# Altium schematic sheet dsPIC33_CPU_ETH_Unit.SchDoc
size A1
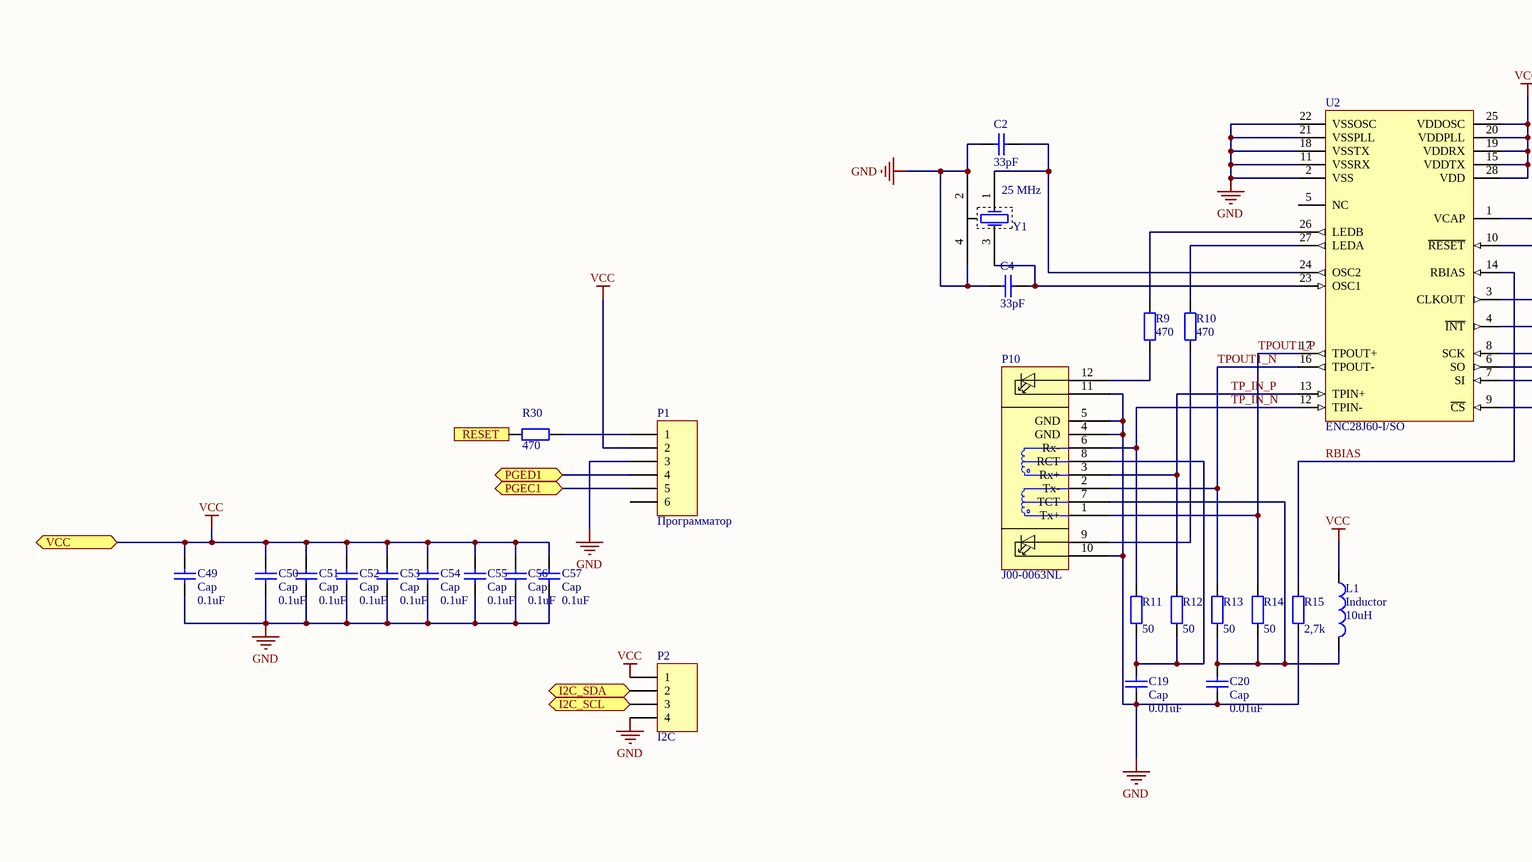
[diagram p0: dsPIC33_CPU_ETH_Unit.SchDoc, left]
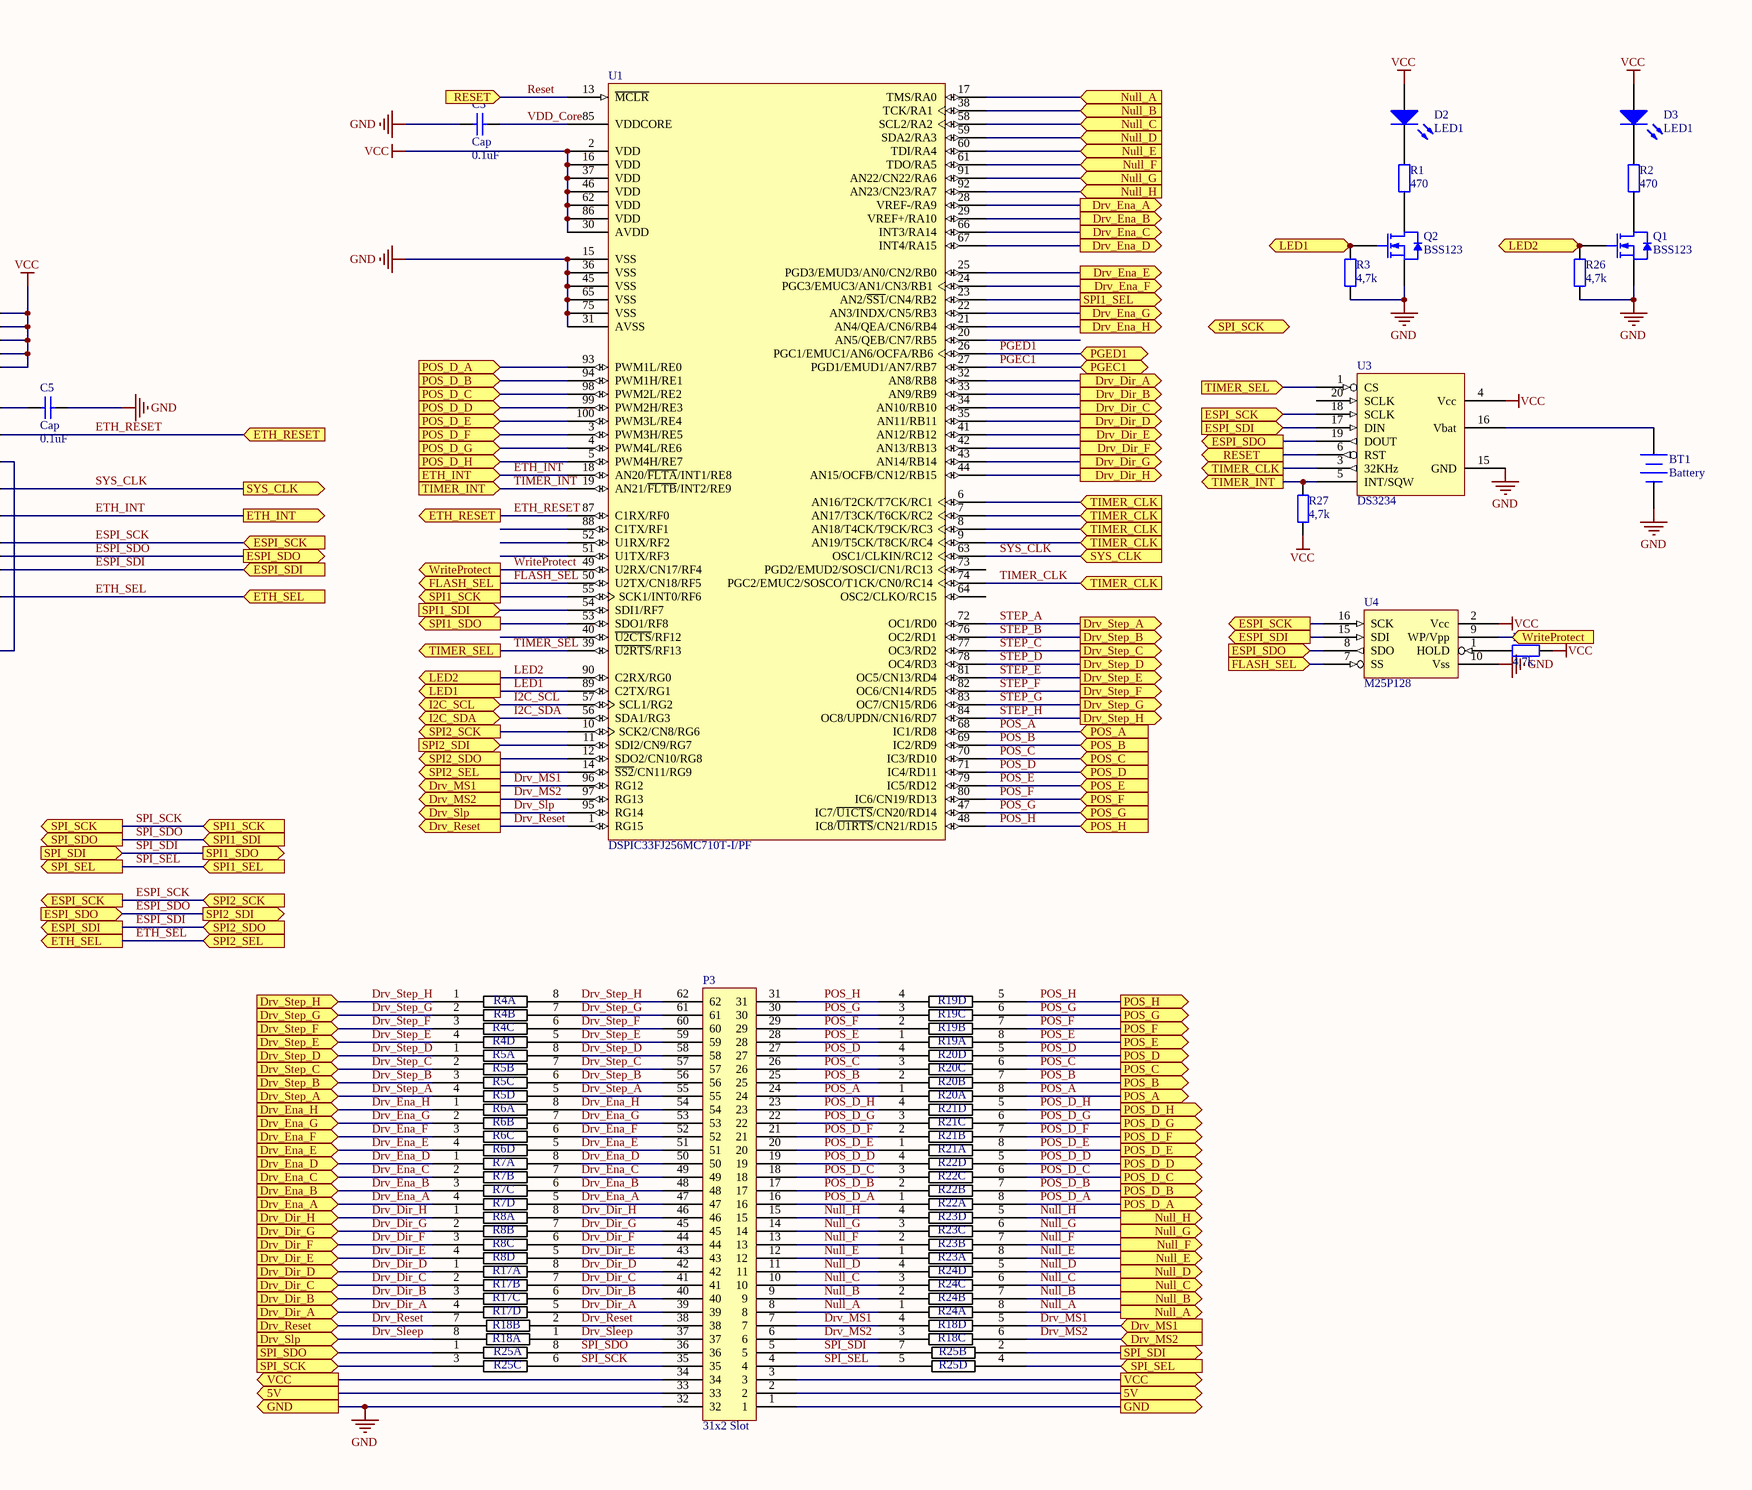
[diagram p1: dsPIC33_CPU_ETH_Unit.SchDoc, right]

## Parts
BT1  Battery  [Battery Pad]
C2  value 33pF  [CAPC2012L]  (hidden comment: Cap)
C3  Cap  value 0.1uF  [CAPC3225L]
C4  value 33pF  [CAPC2012L]  (hidden comment: Cap)
C5  Cap  value 0.1uF  [CAPC3225L]
C19  Cap  value 0.01uF  [CAPC3225L]
C20  Cap  value 0.01uF  [CAPC3225L]
C49  Cap  value 0.1uF  [CAPC3225L]
C50  Cap  value 0.1uF  [CAPC3225L]
C51  Cap  value 0.1uF  [CAPC3225L]
C52  Cap  value 0.1uF  [CAPC3225L]
C53  Cap  value 0.1uF  [CAPC3225L]
C54  Cap  value 0.1uF  [CAPC3225L]
C55  Cap  value 0.1uF  [CAPC3225L]
C56  Cap  value 0.1uF  [CAPC3225L]
C57  Cap  value 0.1uF  [CAPC3225L]
D2  LED1  [LED-1]
D3  LED1  [LED-1]
L1  Inductor  value 10uH  [INDC4532L]
P1  Программатор  [HDR1X6]
P2  I2C  [HDR1X4]
P3  31x2 Slot  [SL-62]
P10  J00-0063NL  [EthernetCON]
Q1  BSS123  [SOT23_N]
Q2  BSS123  [SOT23_N]
R1  value 470  [RESC2012M]  (hidden comment: Res2)
R2  value 470  [RESC2012M]  (hidden comment: Res2)
R3  value 4,7k  [RESC2012M]  (hidden comment: Res2)
R4  CAT16  [CAT16]  (value not drawn)  (parts A,B,C,D of 4)
R5  CAT16  [CAT16]  (value not drawn)  (parts A,B,C,D of 4)
R6  CAT16  [CAT16]  (value not drawn)  (parts A,B,C,D of 4)
R7  CAT16  [CAT16]  (value not drawn)  (parts A,B,C,D of 4)
R8  CAT16  [CAT16]  (value not drawn)  (parts A,B,C,D of 4)
R9  value 470  [RESC2012M]  (hidden comment: Res2)
R10  value 470  [RESC2012M]  (hidden comment: Res2)
R11  value 50  [RESC2012M]  (hidden comment: Res2)
R12  value 50  [RESC2012M]  (hidden comment: Res2)
R13  value 50  [RESC2012M]  (hidden comment: Res2)
R14  value 50  [RESC2012M]  (hidden comment: Res2)
R15  value 2,7k  [RESC2012M]  (hidden comment: Res2)
R16  value 4,7k  [RESC2012M]  (hidden comment: Res2)
R17  CAT16  [CAT16]  (value not drawn)  (parts A,B,C,D of 4)
R18  CAT16  [CAT16]  (value not drawn)  (parts A,B,C,D of 4)
R19  CAT16  [CAT16]  (value not drawn)  (parts A,B,C,D of 4)
R20  CAT16  [CAT16]  (value not drawn)  (parts A,B,C,D of 4)
R21  CAT16  [CAT16]  (value not drawn)  (parts A,B,C,D of 4)
R22  CAT16  [CAT16]  (value not drawn)  (parts A,B,C,D of 4)
R23  CAT16  [CAT16]  (value not drawn)  (parts A,B,C,D of 4)
R24  CAT16  [CAT16]  (value not drawn)  (parts A,B,C,D of 4)
R25  CAT16  [CAT16]  (value not drawn)  (parts A,B,C,D of 4)
R26  value 4,7k  [RESC2012M]  (hidden comment: Res2)
R27  value 4,7k  [RESC2012M]  (hidden comment: Res2)
R30  value 470  [RESC2012M]  (hidden comment: Res2)
U1  DSPIC33FJ256MC710T-I/PF  [TQFP-PT100_N]
U2  ENC28J60-I/SO  [SOIC-SO28_N]
U3  DS3234  [SOIC20_M]
U4  M25P128  [SOIC127P1030-16M]
Y1  value 25 MHz  [HC 49SM]  (hidden comment: Кварцевый резонатор)

## Ports
5V (out), Drv_Dir_A (in), Drv_Dir_A (out), Drv_Dir_B (in), Drv_Dir_B (out), Drv_Dir_C (in), Drv_Dir_C (out), Drv_Dir_D (in), Drv_Dir_D (out), Drv_Dir_E (in), Drv_Dir_E (out), Drv_Dir_F (in), Drv_Dir_F (out), Drv_Dir_G (in), Drv_Dir_G (out), Drv_Dir_H (in), Drv_Dir_H (out), Drv_Ena_A (in), Drv_Ena_A (out), Drv_Ena_B (in), Drv_Ena_B (out), Drv_Ena_C (in), Drv_Ena_C (out), Drv_Ena_D (in), Drv_Ena_D (out), Drv_Ena_E (in), Drv_Ena_E (out), Drv_Ena_F (in), Drv_Ena_F (out), Drv_Ena_G (in), Drv_Ena_G (out), Drv_Ena_H (in), Drv_Ena_H (out), Drv_MS1 (in), Drv_MS1 (out), Drv_MS2 (in), Drv_MS2 (out), Drv_Reset (in), Drv_Reset (out), Drv_Slp (in), Drv_Slp (out), Drv_Step_A (in), Drv_Step_A (out), Drv_Step_B (in), Drv_Step_B (out), Drv_Step_C (in), Drv_Step_C (out), Drv_Step_D (in), Drv_Step_D (out), Drv_Step_E (in), Drv_Step_E (out), Drv_Step_F (in), Drv_Step_F (out), Drv_Step_G (in), Drv_Step_G (out), Drv_Step_H (in), Drv_Step_H (out), ESPI_SCK (in), ESPI_SCK (out), ESPI_SDI (in), ESPI_SDI (out), ESPI_SDO (in), ESPI_SDO (out), ETH_INT (in), ETH_INT (out), ETH_RESET (in), ETH_RESET (out), ETH_SEL (in), ETH_SEL (out), FLASH_SEL (in), FLASH_SEL (out), GND (out), I2C_SCL, I2C_SDA, LED1, LED1 (out), LED2, LED2 (out), Null_A (in), Null_A (out), Null_B (in), Null_B (out), Null_C (in), Null_C (out), Null_D (in), Null_D (out), Null_E (in), Null_E (out), Null_F (in), Null_F (out), Null_G (in), Null_G (out), Null_H (in), Null_H (out), PGEC1, PGED1, POS_A (in), POS_A (out), POS_B (in), POS_B (out), POS_C (in), POS_C (out), POS_D (in), POS_D (out), POS_D_A (in), POS_D_A (out), POS_D_B (in), POS_D_B (out), POS_D_C (in), POS_D_C (out), POS_D_D (in), POS_D_D (out), POS_D_E (in), POS_D_E (out), POS_D_F (in), POS_D_F (out), POS_D_G (in), POS_D_G (out), POS_D_H (in), POS_D_H (out), POS_E (in), POS_E (out), POS_F (in), POS_F (out), POS_G (in), POS_G (out), POS_H (in), POS_H (out), RESET (in), RESET (out), SPI1_SCK (in), SPI1_SCK (out), SPI1_SDI (in), SPI1_SDO (out), SPI1_SEL (in), SPI1_SEL (out), SPI2_SCK (in), SPI2_SCK (out), SPI2_SDI (in), SPI2_SDI (out), SPI2_SDO (in), SPI2_SDO (out), SPI2_SEL (in), SPI2_SEL (out), SPI_SCK (in), SPI_SCK (out), SPI_SDI (in), SPI_SDI (out), SPI_SDO (in), SPI_SDO (out), SPI_SEL (in), SPI_SEL (out), SYS_CLK (in), SYS_CLK (out), TIMER_CLK (in), TIMER_CLK (out), TIMER_INT (in), TIMER_INT (out), TIMER_SEL (in), TIMER_SEL (out), VCC, VCC (out), WriteProtect (in), WriteProtect (out)

## Nets
GND: BT1.2(-) C2.2 C3.1 C4.1 C5.2 C19.1 C20.1 C49.2 C50.2 C51.2 C52.2 C53.2 C54.2 C55.2 C56.2 C57.2 P1.3 P2.4 P3.1 P3.32 P10.4(GND) P10.5(GND) P10.10 P10.11 P10.13(GND) P10.14(GND) Q1.2(S) Q2.2(S) R3.2 R15.1 R26.2 U1.15(VSS) U1.31(AVSS) U1.36(VSS) U1.45(VSS) U1.65(VSS) U1.75(VSS) U2.2(VSS) U2.11(VSSRX) U2.18(VSSTX) U2.21(VSSPLL) U2.22(VSSOSC) U3.2(NC) U3.7(NC) U3.8(NC) U3.9(NC) U3.10(NC) U3.11 U3.12(NC) U3.13 U3.14 U3.15(GND) U4.10(Vss) Y1.2 Y1.4 ; port GND
VCC: C49.1 C50.1 C51.1 C52.1 C53.1 C54.1 C55.1 C56.1 C57.1 D2.1(A) D3.1(A) L1.1 P1.2 P2.1 P3.3 P3.34 R16.2 R27.2 U1.2(VDD) U1.16(VDD) U1.30(AVDD) U1.37(VDD) U1.46(VDD) U1.62(VDD) U1.86(VDD) U2.15(VDDTX) U2.19(VDDRX) U2.20(VDDPLL) U2.25(VDDOSC) U2.28(VDD) U3.4(Vcc) U4.2(Vcc) ; port VCC
5V: P3.2 P3.33 ; port 5V
Drv_Dir_A: P3.39 R17.4 R17.5 U1.32(AN8/RB8) ; port Drv_Dir_A
Drv_Dir_B: P3.40 R17.3 R17.6 U1.33(AN9/RB9) ; port Drv_Dir_B
Drv_Dir_C: P3.41 R17.2 R17.7 U1.34(AN10/RB10) ; port Drv_Dir_C
Drv_Dir_D: P3.42 R17.1 R17.8 U1.35(AN11/RB11) ; port Drv_Dir_D
Drv_Dir_E: P3.43 R8.4 R8.5 U1.41(AN12/RB12) ; port Drv_Dir_E
Drv_Dir_F: P3.44 R8.3 R8.6 U1.42(AN13/RB13) ; port Drv_Dir_F
Drv_Dir_G: P3.45 R8.2 R8.7 U1.43(AN14/RB14) ; port Drv_Dir_G
Drv_Dir_H: P3.46 R8.1 R8.8 U1.44(AN15/OCFB/CN12/RB15) ; port Drv_Dir_H
Drv_Ena_A: P3.47 R7.4 R7.5 U1.28(VREF-/RA9) ; port Drv_Ena_A
Drv_Ena_B: P3.48 R7.3 R7.6 U1.29(VREF+/RA10) ; port Drv_Ena_B
Drv_Ena_C: P3.49 R7.2 R7.7 U1.66(INT3/RA14) ; port Drv_Ena_C
Drv_Ena_D: P3.50 R7.1 R7.8 U1.67(INT4/RA15) ; port Drv_Ena_D
Drv_Ena_E: P3.51 R6.4 R6.5 U1.25(PGD3/EMUD3/AN0/CN2/RB0) ; port Drv_Ena_E
Drv_Ena_F: P3.52 R6.3 R6.6 U1.24(PGC3/EMUC3/AN1/CN3/RB1) ; port Drv_Ena_F
Drv_Ena_G: P3.53 R6.2 R6.7 U1.22(AN3/INDX/CN5/RB3) ; port Drv_Ena_G
Drv_Ena_H: P3.54 R6.1 R6.8 U1.21(AN4/QEA/CN6/RB4) ; port Drv_Ena_H
Drv_MS1: P3.7 R18.4 R18.5 U1.96(RG12) ; port Drv_MS1
Drv_MS2: P3.6 R18.3 R18.6 U1.97(RG13) ; port Drv_MS2
Drv_Reset: P3.38 R18.2 R18.7 U1.1(RG15) ; port Drv_Reset
Drv_Sleep: P3.37 R18.1 R18.8 U1.95(RG14) ; port Drv_Slp  [also labelled Drv_Slp]
Drv_Step_A: P3.55 R5.4 R5.5 U1.72(OC1/RD0) ; port Drv_Step_A  [also labelled STEP_A]
Drv_Step_B: P3.56 R5.3 R5.6 U1.76(OC2/RD1) ; port Drv_Step_B  [also labelled STEP_B]
Drv_Step_C: P3.57 R5.2 R5.7 U1.77(OC3/RD2) ; port Drv_Step_C  [also labelled STEP_C]
Drv_Step_D: P3.58 R5.1 R5.8 U1.78(OC4/RD3) ; port Drv_Step_D  [also labelled STEP_D]
Drv_Step_E: P3.59 R4.4 R4.5 U1.81(OC5/CN13/RD4) ; port Drv_Step_E  [also labelled STEP_E]
Drv_Step_F: P3.60 R4.3 R4.6 U1.82(OC6/CN14/RD5) ; port Drv_Step_F  [also labelled STEP_F]
Drv_Step_G: P3.61 R4.2 R4.7 U1.83(OC7/CN15/RD6) ; port Drv_Step_G  [also labelled STEP_G]
Drv_Step_H: P3.62 R4.1 R4.8 U1.84(OC8/UPDN/CN16/RD7) ; port Drv_Step_H  [also labelled STEP_H]
ESPI_SCK: U1.10(SCK2/CN8/RG6) U2.8(SCK) U3.18(SCLK) U4.16(SCK) ; port SPI2_SCK, port ESPI_SCK
ESPI_SDI: U1.12(SDO2/CN10/RG8) U2.7(SI) U3.17(DIN) U4.15(SDI) ; port SPI2_SDO, port ESPI_SDI
ESPI_SDO: U1.11(SDI2/CN9/RG7) U2.6(SO) U3.19(DOUT) U4.8(SDO) ; port SPI2_SDI, port ESPI_SDO
ETH_INT: U1.18(AN20/~{FLTA}/INT1/RE8) U2.4(~{INT}) ; port ETH_INT
ETH_RESET: U1.87(C1RX/RF0) U2.10(~{RESET}) ; port ETH_RESET
ETH_SEL: U1.14(~{SS2}/CN11/RG9) U2.9(~{CS}) ; port SPI2_SEL, port ETH_SEL
FLASH_SEL: U1.50(U2TX/CN18/RF5) U4.7(SS) ; port FLASH_SEL
I2C_SCL: P2.3 U1.57(SCL1/RG2) ; port I2C_SCL
I2C_SDA: P2.2 U1.56(SDA1/RG3) ; port I2C_SDA
LED1: Q2.1(G) R3.1 U1.89(C2TX/RG1) ; port LED1
LED2: Q1.1(G) R26.1 U1.90(C2RX/RG0) ; port LED2
Null_A: P3.8 R24.1 R24.8 U1.17(TMS/RA0) ; port Null_A
Null_B: P3.9 R24.2 R24.7 U1.38(TCK/RA1) ; port Null_B
Null_C: P3.10 R24.3 R24.6 U1.58(SCL2/RA2) ; port Null_C
Null_D: P3.11 R24.4 R24.5 U1.59(SDA2/RA3) ; port Null_D
Null_E: P3.12 R23.1 R23.8 U1.60(TDI/RA4) ; port Null_E
Null_F: P3.13 R23.2 R23.7 U1.61(TDO/RA5) ; port Null_F
Null_G: P3.14 R23.3 R23.6 U1.91(AN22/CN22/RA6) ; port Null_G
Null_H: P3.15 R23.4 R23.5 U1.92(AN23/CN23/RA7) ; port Null_H
PGEC1: P1.5 U1.27(PGD1/EMUD1/AN7/RB7) ; port PGEC1
PGED1: P1.4 U1.26(PGC1/EMUC1/AN6/OCFA/RB6) ; port PGED1
POS_A: P3.24 R20.1 R20.8 U1.68(IC1/RD8) ; port POS_A
POS_B: P3.25 R20.2 R20.7 U1.69(IC2/RD9) ; port POS_B
POS_C: P3.26 R20.3 R20.6 U1.70(IC3/RD10) ; port POS_C
POS_D: P3.27 R20.4 R20.5 U1.71(IC4/RD11) ; port POS_D
POS_D_A: P3.16 R22.1 R22.8 U1.93(PWM1L/RE0) ; port POS_D_A
POS_D_B: P3.17 R22.2 R22.7 U1.94(PWM1H/RE1) ; port POS_D_B
POS_D_C: P3.18 R22.3 R22.6 U1.98(PWM2L/RE2) ; port POS_D_C
POS_D_D: P3.19 R22.4 R22.5 U1.99(PWM2H/RE3) ; port POS_D_D
POS_D_E: P3.20 R21.1 R21.8 U1.100(PWM3L/RE4) ; port POS_D_E
POS_D_F: P3.21 R21.2 R21.7 U1.3(PWM3H/RE5) ; port POS_D_F
POS_D_G: P3.22 R21.3 R21.6 U1.4(PWM4L/RE6) ; port POS_D_G
POS_D_H: P3.23 R21.4 R21.5 U1.5(PWM4H/RE7) ; port POS_D_H
POS_E: P3.28 R19.1 R19.8 U1.79(IC5/RD12) ; port POS_E
POS_F: P3.29 R19.2 R19.7 U1.80(IC6/CN19/RD13) ; port POS_F
POS_G: P3.30 R19.3 R19.6 U1.47(IC7/~{U1CTS}/CN20/RD14) ; port POS_G
POS_H: P3.31 R19.4 R19.5 U1.48(IC8/~{U1RTS}/CN21/RD15) ; port POS_H
RBIAS: R15.2 U2.14(RBIAS)
Reset: R30.2 U1.13(~{MCLR}) U3.6(RST) ; port RESET
SPI_SCK: P3.35 R25.3 R25.6 U1.55(SCK1/INT0/RF6) ; port SPI1_SCK, port SPI_SCK
SPI_SDI: P3.5 R25.2 R25.7 U1.53(SDO1/RF8) ; port SPI_SDI, port SPI1_SDO
SPI_SDO: P3.36 R25.1 R25.8 U1.54(SDI1/RF7) ; port SPI_SDO, port SPI1_SDI
SPI_SEL: P3.4 R25.4 R25.5 U1.23(AN2/~{SS1}/CN4/RB2) ; port SPI_SEL, port SPI1_SEL
SYS_CLK: U1.63(OSC1/CLKIN/RC12) U2.3(CLKOUT) ; port SYS_CLK
TIMER_CLK: U1.6(AN16/T2CK/T7CK/RC1) U1.7(AN17/T3CK/T6CK/RC2) U1.8(AN18/T4CK/T9CK/RC3) U1.9(AN19/T5CK/T8CK/RC4) U1.74(PGC2/EMUC2/SOSCO/T1CK/CN0/RC14) U3.3(32KHz) ; port TIMER_CLK
TIMER_INT: R27.1 U1.19(AN21/~{FLTB}/INT2/RE9) U3.5(INT/SQW) ; port TIMER_INT
TIMER_SEL: U1.39(~{U2RTS}/RF13) U3.1(CS) ; port TIMER_SEL
TP_IN_N: P10.6(Rx-) R11.2 U2.12(TPIN-)
TP_IN_P: P10.3(Rx+) R12.2 U2.13(TPIN+)
TPOUT1_N: P10.2(Tx-) R13.2 U2.16(TPOUT-)
TPOUT1_P: P10.1(Tx+) R14.2 U2.17(TPOUT+)
VDD_Core: C3.2 U1.85(VDDCORE)
WriteProtect: U1.49(U2RX/CN17/RF4) U4.9(WP/Vpp) ; port WriteProtect
NetBT1_1: BT1.1(+) U3.16(Vbat)
NetC2_1: C2.1 U2.24(OSC2) Y1.1
NetC4_2: C4.2 U2.23(OSC1) Y1.3
NetC5_1: C5.1 U2.1(VCAP)
NetC19_2: C19.2 P10.8(RCT) R11.1 R12.1
NetC20_2: C20.2 L1.2 P10.7(TCT) R13.1 R14.1
NetD2_2: D2.2(K) R1.1
NetD3_2: D3.2(K) R2.1
NetP1_1: P1.1 R30.1
NetP10_9: P10.9 R10.2
NetP10_12: P10.12 R9.2
NetQ1_3: Q1.3(D) R2.2
NetQ2_3: Q2.3(D) R1.2
NetR9_1: R9.1 U2.26(LEDB)
NetR10_1: R10.1 U2.27(LEDA)
NetR16_1: R16.1 U4.1(HOLD)

Not connected (* = marked no-connect by the designer): P1 6; U1 20(AN5/QEB/CN7/RB5) 40(~{U2CTS}/RF12) 51(U1TX/RF3) 52(U1RX/RF2) 64(OSC2/CLKO/RC15) 73(PGD2/EMUD2/SOSCI/CN1/RC13) 88(C1TX/RF1); U2 5(NC); U3 20(SCLK)

## Library data of the parts
BT1 = Battery: Multicell Battery; Published: 24-Mar-1999; LatestRevisionDate: 17-Jul-2002; LatestRevisionNote: Re-released for DXP Platform.; PackageReference: BAT-2; Publisher: Altium Limited
C2-C5 C19 C20 C49-C57 = Cap: Capacitor; Published: 8-Jun-2000; LatestRevisionDate: 17-Jul-2002; LatestRevisionNote: Re-released for DXP Platform.; PackageReference: RAD-0.3; Publisher: Altium Limited
D2 D3 = LED1: Typical RED GaAs LED; Published: 8-Jun-2000; LatestRevisionDate: 08-Jul-2005; LatestRevisionNote: Mech Layer 1 removed.; PackageReference: LED-1; Publisher: Altium Limited
L1 = Inductor: Code_IEC: 1005; Published: 8-Jun-2000; LatestRevisionDate: 29-May-2009; LatestRevisionNote: IPC-7351 Footprint Added.; PackageReference: 0402-A; Publisher: Altium Limited; PackageDescription: Chip Inductor; Code_JEITA: 0402
P1 = Header 6: Header, 6-Pin; LatestRevisionDate: 17-Jul-2002; LatestRevisionNote: Re-released for DXP Platform.; Publisher: Altium Limited
P2 = Header 4: Header, 4-Pin; LatestRevisionDate: 17-Jul-2002; LatestRevisionNote: Re-released for DXP Platform.; Publisher: Altium Limited
Q1 Q2 = BSS123: N-channel Enhancement Mode Vertical D-MOSFET; Published: 17-Sep-2003; LatestRevisionDate: 12-Dec-2006; LatestRevisionNote: IPC-7351 Footprint Added.; DatasheetVersion: Apr-1995; PackageVersion: May-1999; PackageReference: SOT23; Publisher: Altium Limited; PackageDescription: 3-Pin SOT-23 Package 0.95 mm Pitch, 2.3 mm Lead Span; ComponentLink1Description: Manufacturer Link; ComponentLink1URL: http://www.semiconductors.philips.com/; ComponentLink2Description: Datasheet; ComponentLink2URL: http://www.semiconductors.philips.com/acrobat/datasheets/BSS123_3.pdf
R1-R3 R9-R16 R26 R27 R30 = Res2: Resistor; Published: 8-Jun-2000; LatestRevisionDate: 17-Jul-2002; LatestRevisionNote: Re-released for DXP Platform.; PackageReference: AXIAL-0.4; Publisher: Altium Limited
R4-R8 R17-R25 = CAT16: Резисторная сборка; Value: 470
U1 = DSPIC33FJ256MC710T-I/PF: High-Performance 16-bit Digital Signal Controller, 256 KB Flash, 30 KB RAM, 100-Pin TQFP, Industrial Temperature, Tape and Reel; Published: 29-Jan-2009; DatasheetVersion: revA, Jun-2007; PackageVersion: revAW, Oct-2008; PackageReference: TQFP-PF100; Publisher: Altium Limited; PackageDescription: 100-Lead Thin Plastic Quad Flat Pack (PF) - 14x14x1mm Body, 2.00mm [TQFP]; ComponentLink1Description: Manufacturer Link; ComponentLink1URL: http://www.microchip.com; ComponentLink2Description: Datasheet; ComponentLink2URL: http://ww1.microchip.com/downloads/en/DeviceDoc/70287A.pdf; ComponentLink3Description: Packaging Specification; ComponentLink3URL: http://ww1.microchip.com/downloads/en/PackagingSpec/00049AW.pdf
U2 = ENC28J60-I/SO: Stand-Alone Ethernet Controller with SPI Interface, 28-Pin SOIC, Industrial Temperature; Published: 29-Jan-2009; DatasheetVersion: RevC, Jan-2008; PackageVersion: revAW, Oct-2008; PackageReference: SOIC-SO28; Publisher: Altium Limited; PackageDescription: 28-Lead Plastic Small Outline (SO) - Wide 7.50mm Body [SOIC]; Code_JEDEC: MS-013; ComponentLink1Description: Manufacturer Link; ComponentLink1URL: http://www.microchip.com; ComponentLink2Description: Datasheet; ComponentLink2URL: http://ww1.microchip.com/downloads/en/DeviceDoc/39662c.pdf; ComponentLink3Description: Packaging Specification; ComponentLink3URL: http://ww1.microchip.com/downloads/en/PackagingSpec/00049AW.pdf
U3 = DS3234: Extremely Accurate SPI Bus RTC with  Integrated Crystal and SRAM
Y1 = XTAL